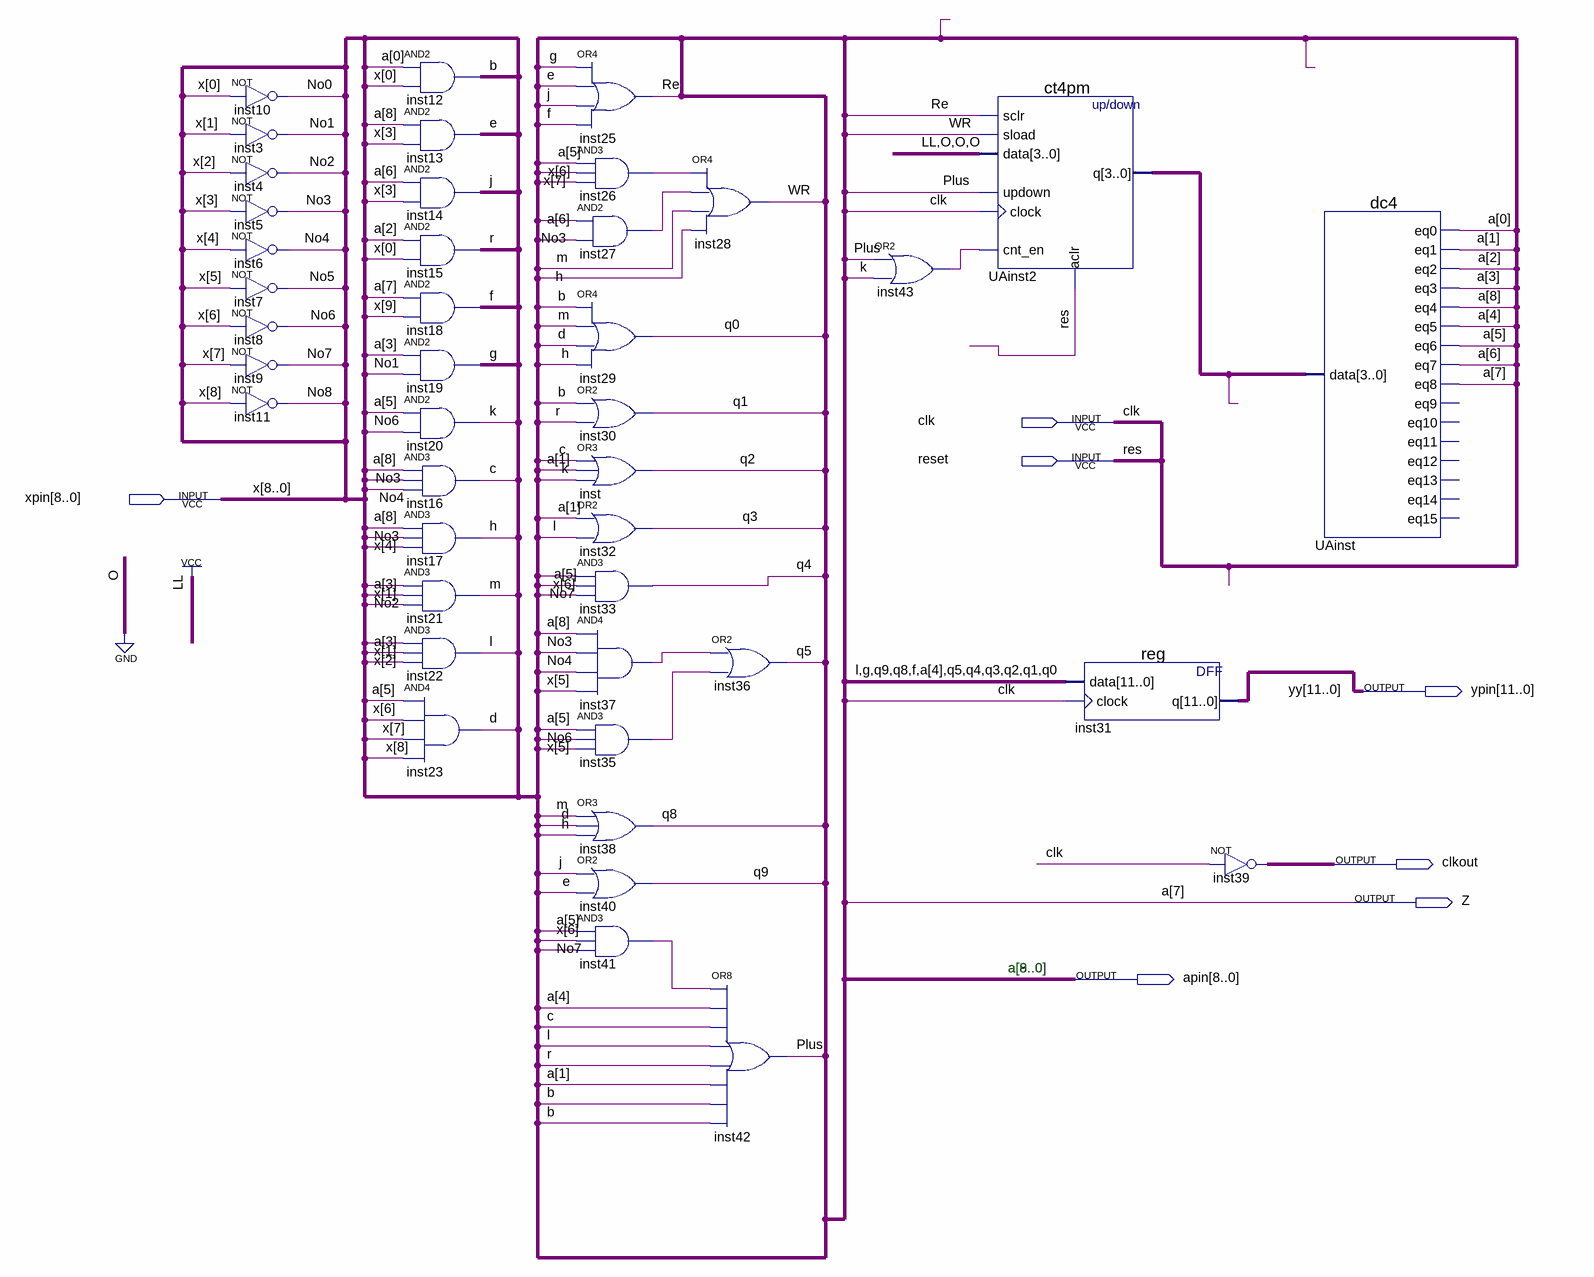
[diagram p0: schematic sheet]
// Quartus schematic UAcourseProject.bdf as structural Verilog: 42 symbols, 7 pins
module UAcourseProject (
  input  clk,
  input  reset,
  input  [8:0] xpin,
  output [11:0] ypin,
  output clkout,
  output Z,
  output [8:0] apin
);

  wire b, c, d, e, f, g, h, inst26_out, inst27_out, inst35_out, inst37_out, inst41_out, inst43_out, j, k, l,
       m, No0, No1, No2, No3, No4, No5, No6, No7, No8, Plus, q0, q1, q2, q3, q4, q5, q8, q9, r, Re, WR;
  wire [3:0] UAinst2_q;
  wire [9:9] x;

  not inst10 (No0, xpin[0]);
  not inst3 (No1, xpin[1]);
  not inst4 (No2, xpin[2]);
  not inst5 (No3, xpin[3]);
  not inst6 (No4, xpin[4]);
  not inst7 (No5, xpin[5]);
  not inst8 (No6, xpin[6]);
  not inst9 (No7, xpin[7]);
  not inst11 (No8, xpin[8]);
  and inst12 (b, apin[0], xpin[0]);
  and inst13 (e, apin[8], xpin[3]);
  and inst14 (j, apin[6], xpin[3]);
  and inst15 (r, apin[2], xpin[0]);
  and inst18 (f, apin[7], x[9]);
  and inst19 (g, apin[3], No1);
  and inst20 (k, apin[5], No6);
  and inst16 (c, apin[8], No3, No4);
  and inst17 (h, apin[8], No3, xpin[4]);
  and inst21 (m, apin[3], xpin[1], No2);
  and inst22 (l, apin[3], xpin[1], xpin[2]);
  and inst23 (d, apin[5], xpin[6], xpin[7], xpin[8]);
  or inst25 (Re, g, e, j, f);
  and inst26 (inst26_out, apin[5], xpin[6], xpin[7]);
  and inst27 (inst27_out, apin[6], No3);
  or inst29 (q0, b, m, d, h);
  or inst30 (q1, b, r);
  or inst (q2, c, apin[1], k);
  or inst32 (q3, apin[1], l);
  and inst33 (q4, apin[5], xpin[6], No7);
  and inst37 (inst37_out, apin[8], No3, No4, xpin[5]);
  and inst35 (inst35_out, apin[5], No6, xpin[5]);
  or inst38 (q8, m, d, h);
  or inst40 (q9, j, e);
  and inst41 (inst41_out, apin[5], xpin[6], No7);
  or inst28 (WR, inst26_out, inst27_out, m, h);
  or inst36 (q5, inst37_out, inst35_out);
  or inst42 (Plus, inst41_out, apin[4], c, l, r, apin[1], b, b);
  or inst43 (inst43_out, Plus, k);
  ct4pm UAinst2 (
    .sclr(Re), .sload(WR), .data(4'b1000), .updown(Plus), .clock(clk), .cnt_en(inst43_out), .aclr(reset),
    .q(UAinst2_q));
  \reg  inst31 (.data({l, g, q9, q8, f, apin[4], q5, q4, q3, q2, q1, q0}), .clock(clk), .q(ypin));
  not inst39 (clkout, clk);
  dc4 UAinst (
    .data(UAinst2_q), .eq0(apin[0]), .eq1(apin[1]), .eq2(apin[2]), .eq3(apin[3]), .eq4(apin[8]),
    .eq5(apin[4]), .eq6(apin[5]), .eq7(apin[6]), .eq8(apin[7]));  // open: eq9, eq10, eq11, eq12, eq13, eq14, eq15

  assign Z = apin[7];

  // Other names for the same wires on the sheet: a[8:0] = apin; res = reset; x[8:0] = xpin; yy[11:0] = ypin

  // Notes on the sheet:
  //   a[9..0]
endmodule
